# EAGLE design 3 (EAGLE 6.1)
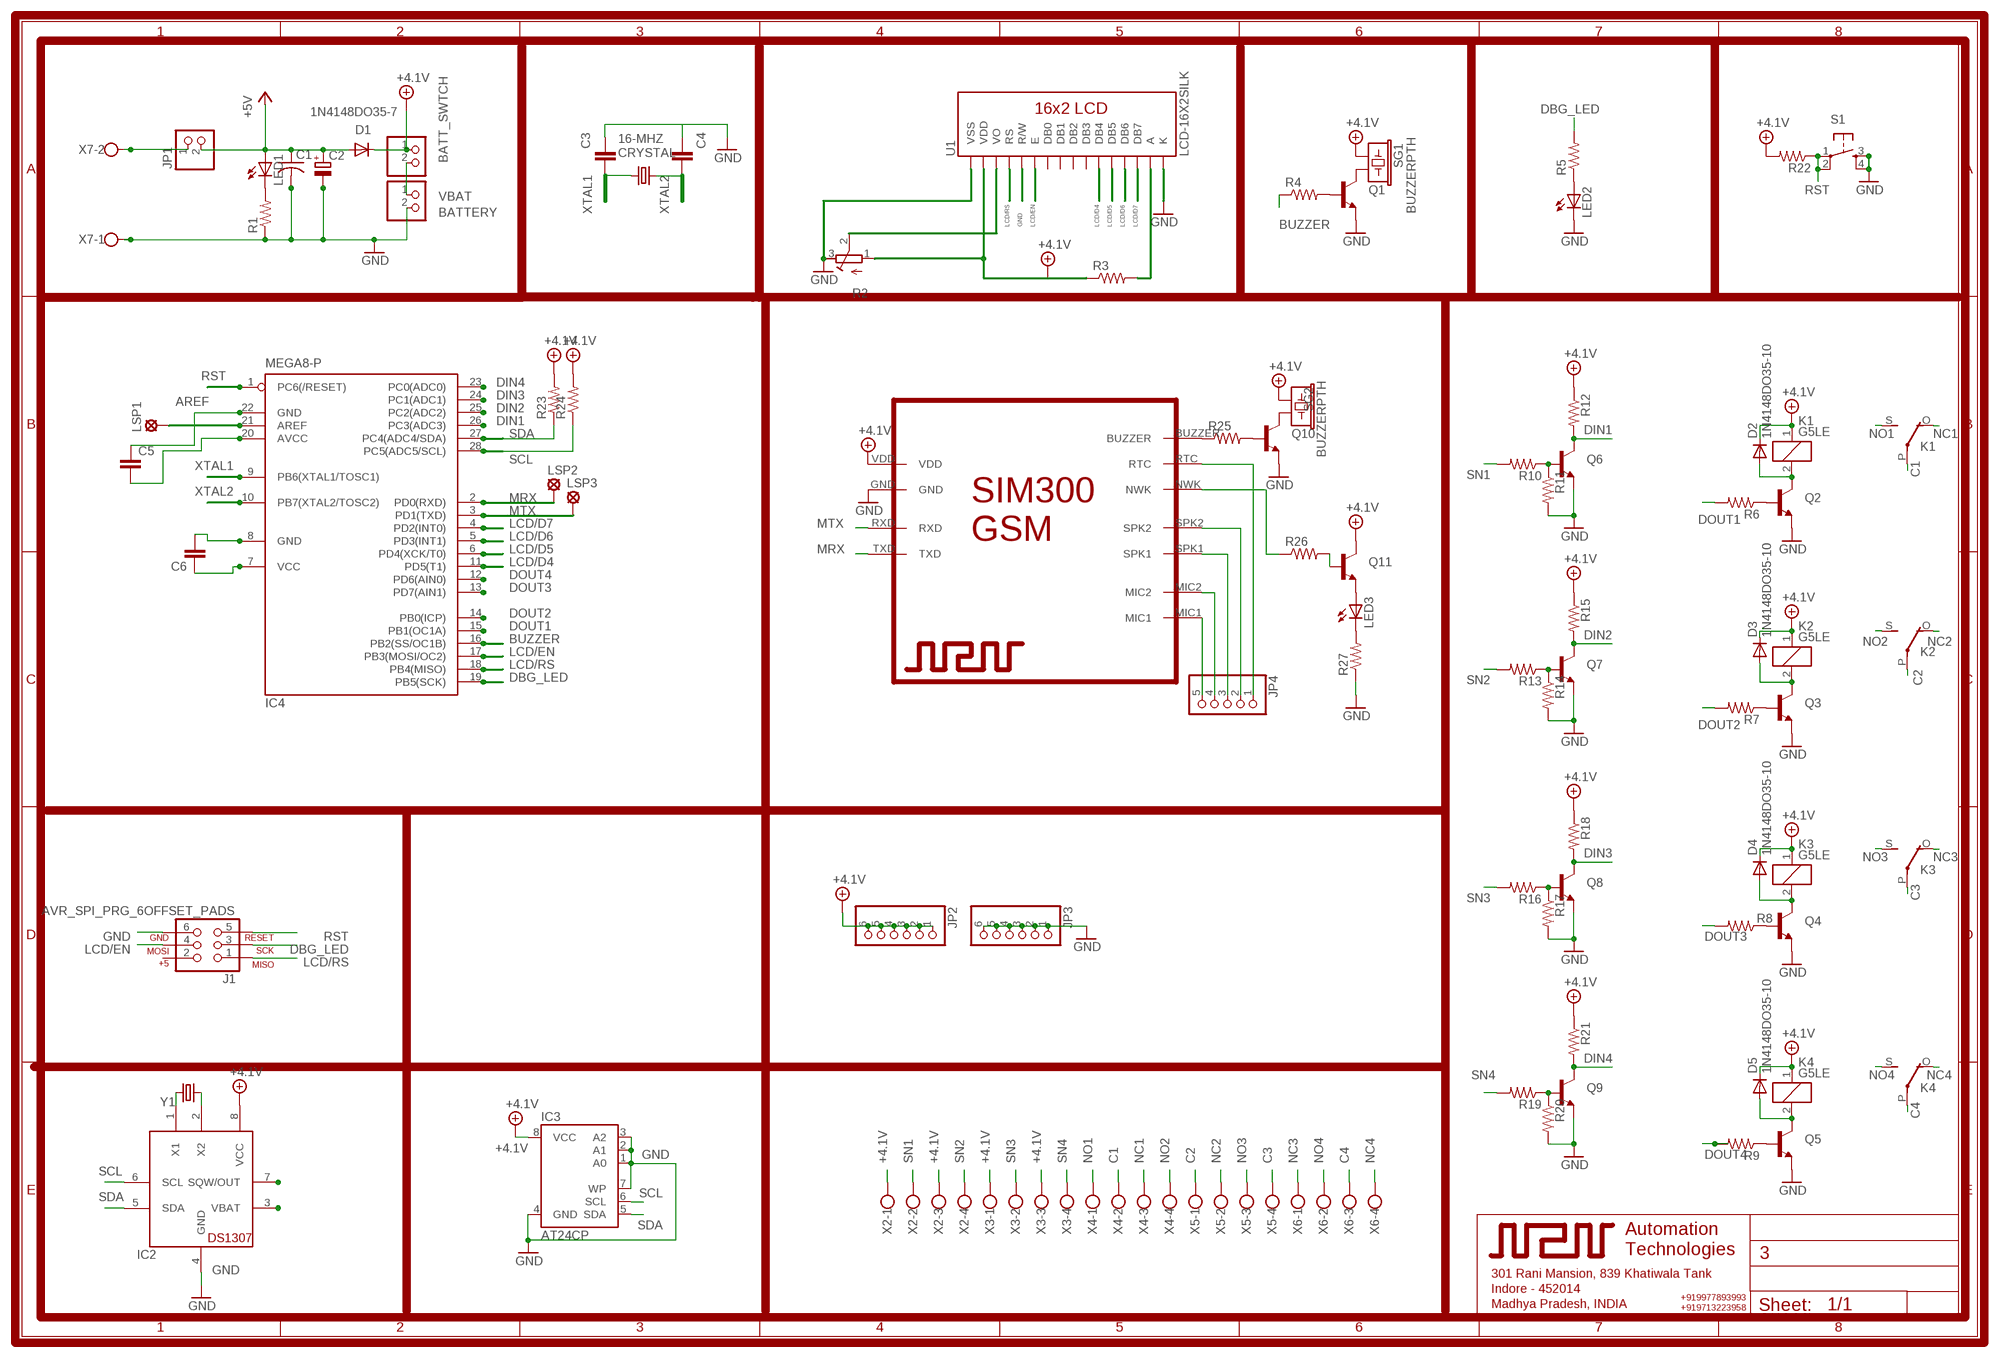
[diagram p0: schematic, sheet 1]

## Parts
BATT_SWTCH  PINHD-1X2  [1X02]
BATTERY  PINHD-1X2  [1X02]
C1  C-US050-035X075  [C050-035X075]
C2  CPOL-EUE3.5-8  [E3,5-8]
C3  CAPPTH1  [CAP-PTH-5MM]
C4  CAPPTH1  [CAP-PTH-5MM]
C5  CAPPTH1  [CAP-PTH-5MM]
C6  CAPPTH1  [CAP-PTH-5MM]
CRYSTAL  16-MHZ  CRYSTALHC49UV  [HC49U-V]
D1  1N4148DO35-7  [DO35-7]
D2  1N4148DO35-10  [DO35-10]
D3  1N4148DO35-10  [DO35-10]
D4  1N4148DO35-10  [DO35-10]
D5  1N4148DO35-10  [DO35-10]
IC2  DS1307  [DIL08]
IC3  AT24CP  [DIL08]
IC4  MEGA8-P  [DIL28-3]
J1  AVR_SPI_PRG_6OFFSET_PADS  [2X3_OFFSET]
JP1  PINHD-1X2  [1X02]
JP2  PINHD-1X6  [1X06]
JP3  PINHD-1X6  [1X06]
JP4  PINHD-1X5  [1X05]
K1  G5LE  [G5LE]
K2  G5LE  [G5LE]
K3  G5LE  [G5LE]
K4  G5LE  [G5LE]
LED1  LED5MM  [LED5MM]
LED2  LED5MM  [LED5MM]
LED3  LED5MM  [LED5MM]
LSP1  LSP11  [LSP11]
LSP2  MCS10B  [MCS10B]
LSP3  MCS10B  [MCS10B]
Q1  TRANSISTOR_NPNTO-92-AMMO  [TO-92-AMMO]
Q2  TRANSISTOR_NPNTO-92-AMMO  [TO-92-AMMO]
Q3  TRANSISTOR_NPNTO-92-AMMO  [TO-92-AMMO]
Q4  TRANSISTOR_NPNTO-92-AMMO  [TO-92-AMMO]
Q5  TRANSISTOR_NPNTO-92-AMMO  [TO-92-AMMO]
Q6  TRANSISTOR_NPNTO-92-AMMO  [TO-92-AMMO]
Q7  TRANSISTOR_NPNTO-92-AMMO  [TO-92-AMMO]
Q8  TRANSISTOR_NPNTO-92-AMMO  [TO-92-AMMO]
Q9  TRANSISTOR_NPNTO-92-AMMO  [TO-92-AMMO]
Q10  TRANSISTOR_NPNTO-92-AMMO  [TO-92-AMMO]
Q11  TRANSISTOR_NPNTO-92-AMMO  [TO-92-AMMO]
R1  RESISTORPTH-1/2W  [AXIAL-0.5]
R2  R-TRIMM3339P  [RTRIM3339P]
R3  RESISTORPTH-2W  [AXIAL-0.8]
R4  RESISTORPTH-1/2W  [AXIAL-0.5]
R5  RESISTORPTH-1/2W  [AXIAL-0.5]
R6  RESISTORPTH-1/2W  [AXIAL-0.5]
R7  RESISTORPTH-1/2W  [AXIAL-0.5]
R8  RESISTORPTH-1/2W  [AXIAL-0.5]
R9  RESISTORPTH-1/2W  [AXIAL-0.5]
R10  RESISTORPTH-1/2W  [AXIAL-0.5]
R11  RESISTORPTH-1/2W  [AXIAL-0.5]
R12  RESISTORPTH-1/2W  [AXIAL-0.5]
R13  RESISTORPTH-1/2W  [AXIAL-0.5]
R14  RESISTORPTH-1/2W  [AXIAL-0.5]
R15  RESISTORPTH-1/2W  [AXIAL-0.5]
R16  RESISTORPTH-1/2W  [AXIAL-0.5]
R17  RESISTORPTH-1/2W  [AXIAL-0.5]
R18  RESISTORPTH-1/2W  [AXIAL-0.5]
R19  RESISTORPTH-1/2W  [AXIAL-0.5]
R20  RESISTORPTH-1/2W  [AXIAL-0.5]
R21  RESISTORPTH-1/2W  [AXIAL-0.5]
R22  RESISTORPTH-1/2W  [AXIAL-0.5]
R23  RESISTORPTH-1/2W  [AXIAL-0.5]
R24  RESISTORPTH-1/2W  [AXIAL-0.5]
R25  RESISTORPTH-1/2W  [AXIAL-0.5]
R26  RESISTORPTH-1/2W  [AXIAL-0.5]
R27  RESISTORPTH-1/2W  [AXIAL-0.5]
S1  TAC_SWITCHPTH  [TACTILE-PTH]
SG1  BUZZERPTH  [BUZZER-12MM]
SG2  BUZZERPTH  [BUZZER-12MM]
U1  LCD-16X2SILK  [LCD-16X2]
U$1  SIM300  [1X10]
X2  W237-4  [W237-4]
X3  W237-4  [W237-4]
X4  W237-4  [W237-4]
X5  W237-4  [W237-4]
X6  W237-4  [W237-4]
X7  W237-102  [W237-102]
Y1  CRYSTALTC38H  [TC38H]

## Nets
+4.1V: BATT_SWTCH.1 C5.2 C6.1 D1.C D2.C D3.C D4.C D5.C IC2.8(VCC) IC3.8(VCC) IC4.7(VCC) IC4.20(AVCC) JP2.1 JP2.2 JP2.3 JP2.4 JP2.5 JP2.6 K1.1 K2.1 K3.1 K4.1 Q11.3(C) R2.1(A) R3.P$1 R12.P$1 R15.P$1 R18.P$1 R21.P$1 R22.P$2 R23.P$2 R24.P$2 SG1.+ SG2.+ U1.2(VDD) U$1.VDD X2.1 X2.3 X3.1 X3.3
+5V: C1.1 C2.+ D1.A JP1.2 LED1.A
AREF: IC4.21(AREF) LSP1.MP
BUZZER: IC4.16(PB2(SS/OC1B)) R4.P$1
C1: K1.P(2:P) X4.2
C2: K2.P(2:P) X5.1
C3: K3.P(2:P) X5.4
C4: K4.P(2:P) X6.3
DBG_LED: IC4.19(PB5(SCK)) J1.3 R5.P$2
DIN1: IC4.26(PC3(ADC3)) Q6.3(C) R12.P$2
DIN2: IC4.25(PC2(ADC2)) Q7.3(C) R15.P$2
DIN3: IC4.24(PC1(ADC1)) Q8.3(C) R18.P$2
DIN4: IC4.23(PC0(ADC0)) Q9.3(C) R21.P$2
DOUT1: IC4.15(PB1(OC1A)) R6.P$2
DOUT2: IC4.14(PB0(ICP)) R7.P$2
DOUT3: IC4.13(PD7(AIN1)) R8.P$2
DOUT4: IC4.12(PD6(AIN0)) R9.P$2
GND: BATTERY.2 C1.2 C2.- C3.1 C4.1 C5.1 C6.2 IC2.4(GND) IC3.1(A0) IC3.2(A1) IC3.3(A2) IC3.4(GND) IC3.7(WP) IC4.8(GND) IC4.22(GND) J1.6 JP3.1 JP3.2 JP3.3 JP3.4 JP3.5 JP3.6 LED2.K(C) Q1.1(E) Q2.1(E) Q3.1(E) Q4.1(E) Q5.1(E) Q6.1(E) Q7.1(E) Q8.1(E) Q9.1(E) Q10.1(E) R1.P$1 R2.3(E) R11.P$2 R14.P$2 R17.P$2 R20.P$2 R27.P$1 S1.3 S1.4 U1.1(VSS) U1.5(R/W) U1.16(K) U$1.GND X7.1
LCD/D4: IC4.11(PD5(T1)) U1.11(DB4)
LCD/D5: IC4.6(PD4(XCK/T0)) U1.12(DB5)
LCD/D6: IC4.5(PD3(INT1)) U1.13(DB6)
LCD/D7: IC4.4(PD2(INT0)) U1.14(DB7)
LCD/EN: IC4.17(PB3(MOSI/OC2)) J1.4 U1.6(E)
LCD/RS: IC4.18(PB4(MISO)) J1.1 U1.4(RS)
MRX: IC4.2(PD0(RXD)) LSP2.MP U$1.TXD
MTX: IC4.3(PD1(TXD)) LSP3.MP U$1.RXD
N$1: JP1.1 X7.2
N$2: LED1.K(C) R1.P$2
N$3: LED3.A Q11.1(E)
N$6: R2.2(S) U1.3(VO)
N$7: Q1.3(C) SG1.-
N$8: Q1.2(B) R4.P$2
N$9: LED2.A R5.P$1
N$10: D2.A K1.2 Q2.3(C)
N$11: Q2.2(B) R6.P$1
N$12: D3.A K2.2 Q3.3(C)
N$13: Q3.2(B) R7.P$1
N$14: R3.P$2 U1.15(A)
N$17: D4.A K3.2 Q4.3(C)
N$18: Q4.2(B) R8.P$1
N$19: D5.A K4.2 Q5.3(C)
N$20: Q5.2(B) R9.P$1
N$21: Q6.2(B) R10.P$1 R11.P$1
N$22: JP4.5 U$1.MIC1
N$23: JP4.4 U$1.MIC2
N$24: JP4.3 U$1.SPK1
N$25: Q7.2(B) R13.P$1 R14.P$1
N$26: JP4.2 U$1.SPK2
N$27: JP4.1 U$1.RTC
N$28: Q8.2(B) R16.P$1 R17.P$1
N$29: IC2.1(X1) Y1.2
N$30: R25.P$1 U$1.BUZZER
N$31: Q9.2(B) R19.P$1 R20.P$1
N$32: IC2.2(X2) Y1.1
N$33: Q10.2(B) R25.P$2
N$34: Q10.3(C) SG2.-
N$35: Q11.2(B) R26.P$2
N$36: LED3.K(C) R27.P$2
N$37: R26.P$1 U$1.NWK
N$40: IC2.7(SQW/OUT)
NC1: K1.O(2:O) X4.3
NC2: K2.O(2:O) X5.2
NC3: K3.O(2:O) X6.1
NC4: K4.O(2:O) X6.4
NO1: K1.S(2:S) X4.1
NO2: K2.S(2:S) X4.4
NO3: K3.S(2:S) X5.3
NO4: K4.S(2:S) X6.2
RST: IC4.1(PC6(/RESET)) J1.5 R22.P$1 S1.1 S1.2
SCL: IC2.6(SCL) IC3.6(SCL) IC4.28(PC5(ADC5/SCL)) R24.P$1
SDA: IC2.5(SDA) IC3.5(SDA) IC4.27(PC4(ADC4/SDA)) R23.P$1
SN1: R10.P$2 X2.2
SN2: R13.P$2 X2.4
SN3: R16.P$2 X3.2
SN4: R19.P$2 X3.4
VBAT: BATT_SWTCH.2 BATTERY.1 IC2.3(VBAT)
XTAL1: C3.2 CRYSTAL.1 IC4.9(PB6(XTAL1/TOSC1))
XTAL2: C4.2 CRYSTAL.2 IC4.10(PB7(XTAL2/TOSC2))
Unconnected: J1.2 U1.7(DB0) U1.8(DB1) U1.9(DB2) U1.10(DB3)

## Library data of the parts
BATT_SWTCH BATTERY JP1 = pinhead:PINHD-1X2: PIN HEADER
C1 = rcl:C-US: CAPACITOR, American symbol
C2 = rcl:CPOL-EU: POLARIZED CAPACITOR, European symbol
C3-C6 = SparkFun_NPN:CAP: Capacitor Standard 0603 ceramic capacitor, and 0.1" leaded capacitor.
CRYSTAL Y1 = SparkFun_NPN:CRYSTAL: Crystals Various standard crystals. Proven footprints. Spark Fun Electronics SKU : COM-00534
D1-D5 = diode:1N4148: DIODE high speed (Philips)
IC2 = adafruit:DS1307: DS1307 Real time clock (RTC) with battery backup ability. Talk to it via i2c
IC3 = atmel:AT24C*: 2-wire serial EEPROM; MPN: AT24C1024BW-SH-B; OC_FARNELL: 1362646; OC_NEWARK: 03P2044
IC4 = atmel:MEGA8-P: MICROCONTROLLER 8 Kbytes FLASH, 1 kbytes SRAM, 512 bytes EEPROM, USART, 4-channel 10 bit ADC, 2-channel 8 bit ADC Pin compatible with Atmega48, ATMega88, ATMega168 Source: avr.lbr; OC_FARNELL: unknown; OC_NEWARK: unknown
J1 = SparkFun:AVR_SPI_PRG_6: AVR ISP 6 Pin This is the reduced ISP connector for AVR programming. Common on Arduino. This footprint will take up less PCB space and can be used with a 10-pin to 6-pin adapter such as SKU: BOB-08508
JP2 JP3 = pinhead:PINHD-1X6: PIN HEADER
JP4 = pinhead:PINHD-1X5: PIN HEADER
K1-K4 = relay:G5LE: RELAY 1 x switch, 10 A/120 V AC, 8 A/30 V DC, Omron; OC_FARNELL: unknown; OC_NEWARK: unknown
LED1-LED3 = led:LED: LED OSRAM: - CHIPLED LG R971, LG N971, LY N971, LG Q971, LY Q971, LO R971, LY R971 LH N974, LH R974 LS Q976, LO Q976, LY Q976 LO Q996 - Hyper CHIPLED LW Q18S LB Q993, LB Q99A, LB R99A - SideLED LS A670, LO A670, LY A670, LG A670, LP A670 LB A673, LV A673, LT A673, LW A673 LH A674 LY A675 LS A676, LA A676, LO A676, LY A676, LW A676 LS A679, LY A679, LG A679 - Hyper Micro SIDELED® LS Y876, LA Y876, LO Y876, LY Y876 LT Y87S - SmartLED LW L88C, LW L88S LB L89C, LB L89S, LG L890 LS L89K, LO L89K, LY L89K LS L896, LA L896, LO L896, LY L896 - TOPLED LS T670, LO T670, LY T670, LG T670, LP T670 LSG T670, LSP T670, LSY T670, LOP T670, LYG T670 LG T671, LOG T671, LSG T671 LB T673, LV T673, LT T673, LW T673 LH T674 LS T676, LA T676, LO T676, LY T676, LB T676, LH T676, LSB T676, LW T676 LB T67C, LV T67C, LT T67C, LS T67K, LO T67K, LY T67K, LW E67C LS E67B, LA E67B, LO E67B, LY E67B, LB E67C, LV E67C, LT E67C LW T67C LS T679, LY T679, LG T679 LS T770, LO T770, LY T770, LG T770, LP T770 LB T773, LV T773, LT T773, LW T773 LH T774 LS E675, LA E675, LY E675, LS T675 LS T776, LA T776, LO T776, LY T776, LB T776 LHGB T686 LT T68C, LB T68C - Hyper Mini TOPLED® LB M676 - Mini TOPLED Santana® LG M470 LS M47K, LO M47K, LY M47K Source: http://www.osram.convergy.de LUXEON: - LUMILED® LXK2-PW12-R00, LXK2-PW12-S00, LXK2-PW14-U00, LXK2-PW14-V00 LXK2-PM12-R00, LXK2-PM12-S00, LXK2-PM14-U00 LXK2-PE12-Q00, LXK2-PE12-R00, LXK2-PE12-S00, LXK2-PE14-T00, LXK2-PE14-U00 LXK2-PB12-K00, LXK2-PB12-L00, LXK2-PB12-M00, LXK2-PB14-N00, LXK2-PB14-P00, LXK2-PB14-Q00 LXK2-PR12-L00, LXK2-PR12-M00, LXK2-PR14-Q00, LXK2-PR14-R00 LXK2-PD12-Q00, LXK2-PD12-R00, LXK2-PD12-S00 LXK2-PH12-R00, LXK2-PH12-S00 LXK2-PL12-P00, LXK2-PL12-Q00, LXK2-PL12-R00 Source: www.luxeon.com KINGBRIGHT: KA-3528ASYC Source: www.kingbright.com
LSP1 = solpad:LSP11: SOLDER PAD drill 1.1 mm
LSP2 LSP3 = solpad:MCS10B: SOLDER PAD MC S1, distributor Buerklin, 15F505
Q1-Q11 = SparkFun_NPN:TRANSISTOR_NPN: Transistor NPN BJT configuration in SOT23 package. MMBT2222 is the common NPN we use. Double check BCE configuration again layout.
R1 R3-R27 = SparkFun_NPN:RESISTOR: Resistor Basic schematic elements and footprints for 0603, 1206, and PTH resistors.
R2 = rcl:R-TRIMM: Trimm resistor
S1 = SparkFun_NPN:TAC_SWITCH: Momentary Switch Button commonly used for reset or general input. Spark Fun Electronics SKU : COM-00097
SG1 SG2 = SparkFun_NPN:BUZZER: Buzzer 12mm Spark Fun Electronics SKU : Comp-Buzzer
U1 = SparkFun_NPN:LCD-16X2
U$1 = NPN:SIM300
X2-X6 = con-wago-500:W237-4: WAGO SCREW CLAMP; OC_FARNELL: unknown; OC_NEWARK: unknown
X7 = con-wago-500:W237-102: WAGO SCREW CLAMP; MPN: 237-102; OC_FARNELL: unknown; OC_NEWARK: 70K9898

## Board
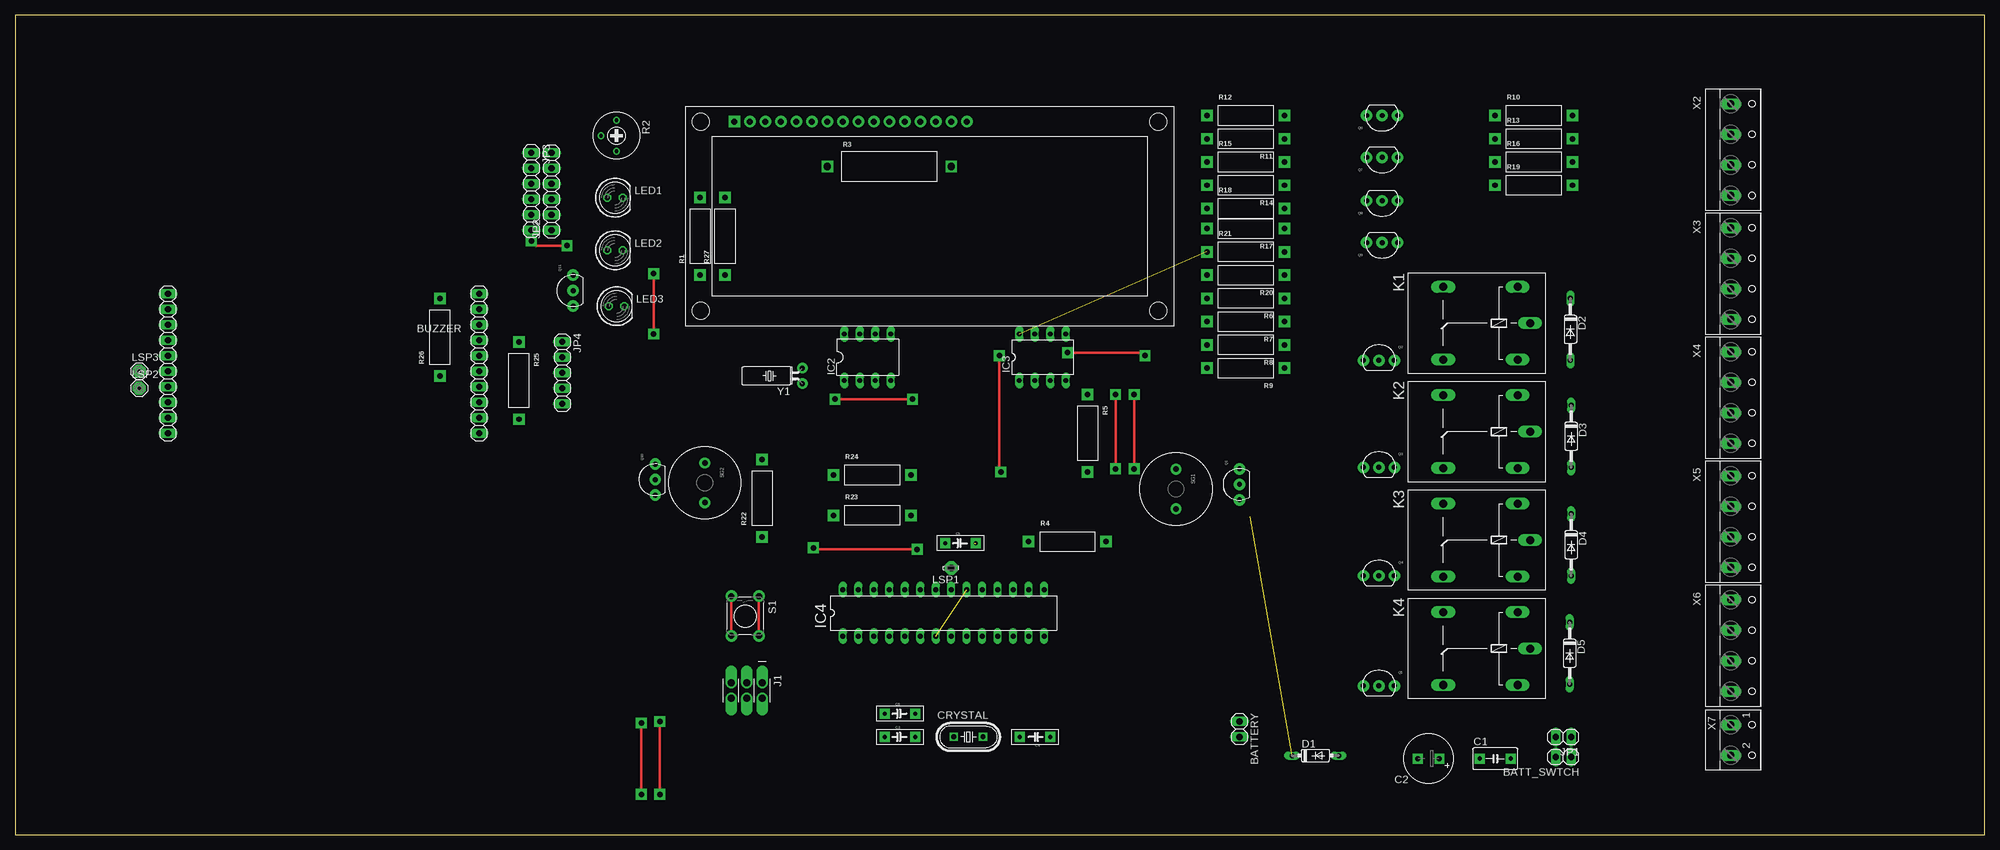
[diagram p1: board, top side]
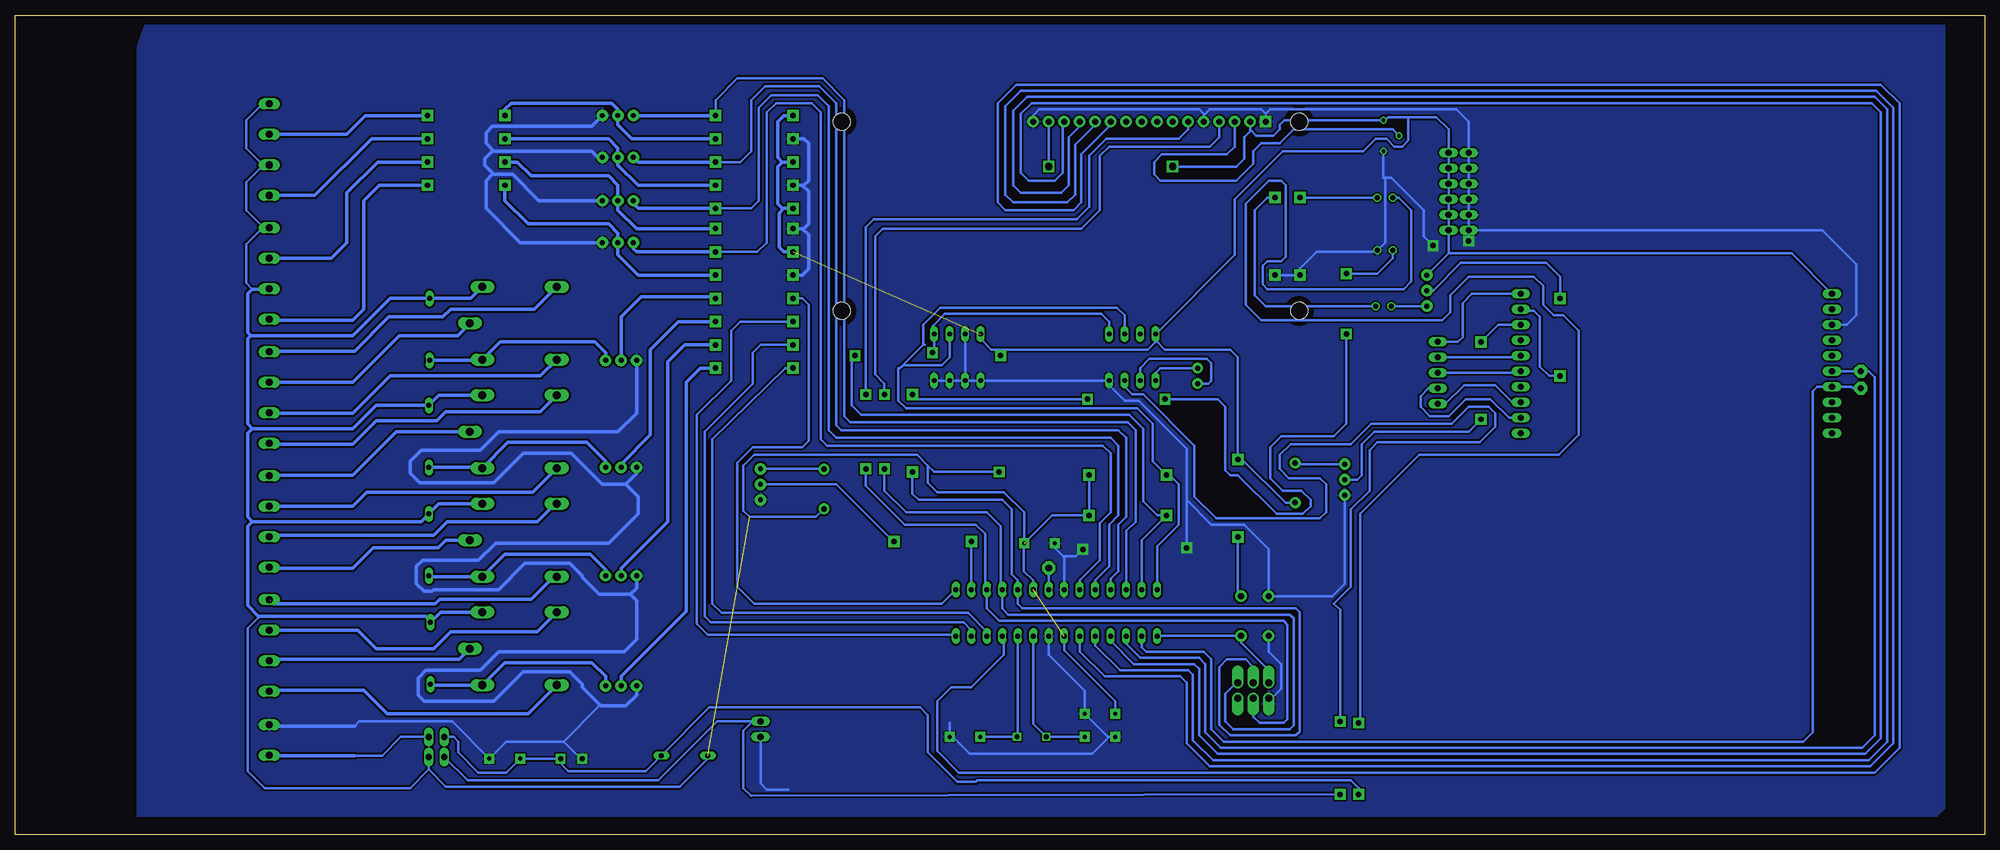
[diagram p2: board, bottom side, seen from below]

Size 322.81 x 134.29 mm. Coordinates in mm from the lower left corner, seen from the top.
Outline: 0,0 322.81,0 322.81,134.29 0,134.29 0,0
Copper layers (1*16): Top 0.035mm / dielectric 1.5mm / Bottom 0.035mm
Design rules: minimum track width 10mil, minimum drill 24mil, track to track 8mil, track to pad 8mil, pad to pad 8mil, via to via 8mil, smd to smd 8mil, copper to edge 40mil, drill to drill 8mil, minimum pad ring 10mil, minimum via ring 8mil, stop-mask expansion 4mil, vias tented up to drill 0mil, thermal gap 10mil

### Footprints (pad centres in the part's own frame; a part is rotated, then mirrored left to right if it is on the bottom)
1X02 = drill 1.016 long: 1 -1.27,0; 2 1.27,0
C050-035X075 = drill 0.7 pad 1.676 square: 1 -2.54,0; 2 2.54,0
E3,5-8 = drill 0.813 pad 1.6 square: + -1.778,0; - 1.778,0
CAP-PTH-5MM = drill 0.7 pad 1.651 square: 1 -2.5,0; 2 2.5,0
HC49U-V = drill 0.813 square: 1 -2.413,0; 2 2.413,0
DO35-7 = drill 0.813 long: A 3.81,0; C -3.81,0
DO35-10 = drill 0.813 long: A 5.08,0; C -5.08,0
DIL08 = drill 0.813 long: 1 -3.81,-3.81; 2 -1.27,-3.81; 3 1.27,-3.81; 4 3.81,-3.81; 5 3.81,3.81; 6 1.27,3.81; 7 -1.27,3.81; 8 -3.81,3.81
DIL28-3 = drill 0.813 long: 1 -16.51,-3.81; 2 -13.97,-3.81; 3 -11.43,-3.81; 4 -8.89,-3.81; 5 -6.35,-3.81; 6 -3.81,-3.81; 7 -1.27,-3.81; 8 1.27,-3.81; 9 3.81,-3.81; 10 6.35,-3.81; 11 8.89,-3.81; 12 11.43,-3.81; 13 13.97,-3.81; 14 16.51,-3.81; 15 16.51,3.81; 16 13.97,3.81; 17 11.43,3.81; 18 8.89,3.81; 19 6.35,3.81; 20 3.81,3.81; 21 1.27,3.81; 22 -1.27,3.81; 23 -3.81,3.81; 24 -6.35,3.81; 25 -8.89,3.81; 26 -11.43,3.81; 27 -13.97,3.81; 28 -16.51,3.81
2X3_OFFSET = drill 1.118 pad 1.88 offset: 1 -2.54,-1.27; 2 -2.54,1.27; 3 0,-1.27; 4 0,1.27; 5 2.54,-1.27; 6 2.54,1.27
1X06 = drill 1.016 long: 1 -6.35,0; 2 -3.81,0; 3 -1.27,0; 4 1.27,0; 5 3.81,0; 6 6.35,0
1X05 = drill 1.016 long: 1 -5.08,0; 2 -2.54,0; 3 0,0; 4 2.54,0; 5 5.08,0
G5LE = drill 1.321 long: 1 -7.493,-5.969; 2 -7.493,5.969; O 4.699,5.969; P -9.525,0; S 4.699,-5.969
LED5MM = drill 0.813 octagon: A -1.27,0; K 1.27,0
LSP11 = drill 1.118 pad 2.159 octagon: MP 0,0
MCS10B = drill 1.016 pad 2.159 octagon: MP 0,0
TO-92-AMMO = drill 0.813 pad 1.88: 1 -2.54,0; 2 0,0; 3 2.54,0
AXIAL-0.5 = drill 0.9 pad 1.88 square: P$1 -6.35,0; P$2 6.35,0
RTRIM3339P = drill 0.61: 1 -2.54,0; 2 0,-2.54; 3 2.54,0
AXIAL-0.8 = drill 1.2 pad 1.88 square: P$1 -10.16,0; P$2 10.16,0
TACTILE-PTH = drill 1.016 pad 1.88: 1 -3.251,2.261; 2 3.251,2.261; 3 -3.251,-2.261; 4 3.251,-2.261
BUZZER-12MM = drill 0.9 pad 1.778: + 3.25,0; - -3.25,0
LCD-16X2 = drill 1.016 pad 1.88 square: 1 -32,15.5 | drill 1.016 pad 1.88: 2 -29.46,15.5; 3 -26.92,15.5; 4 -24.38,15.5; 5 -21.84,15.5; 6 -19.3,15.5; 7 -16.76,15.5; 8 -14.22,15.5; 9 -11.68,15.5; 10 -9.14,15.5; 11 -6.6,15.5; 12 -4.06,15.5; 13 -1.52,15.5; 14 1.02,15.5; 15 3.56,15.5; 16 6.1,15.5 | hole 2.8: -37.5,15.5; -37.5,-15.5; 37.5,15.5; 37.5,-15.5
1X10 = drill 1.016 long: 17 25.5,3.81; ADC0 -25.5,-11.43; AGND 25.5,-3.81; BUZZER 25.5,6.35; CTS -25.5,-8.89; GND -25.5,6.35; GND1 -25.5,3.81; GND2 25.5,-11.43; MIC1 25.5,-6.35; MIC2 25.5,-8.89; NWK 25.5,8.89; PS-ON -25.5,1.27; RTC 25.5,11.43; RTS -25.5,-6.35; RXD -25.5,-1.27; SPK1 25.5,-1.27; SPK2 25.5,1.27; TXD -25.5,-3.81; VDD -25.5,11.43; VDD1 -25.5,8.89
W237-4 = drill 1.194 long: 1 -7.5,-1.27; 2 -2.5,-1.27; 3 2.5,-1.27; 4 7.5,-1.27
W237-102 = drill 1.194 long: 1 -2.5,-1.27; 2 2.5,-1.27
TC38H = drill 0.813 pad 1.676: 1 -1.27,0; 2 1.27,0

### Placement (x,y rotation side)
BATT_SWTCH  253.75,12.7 180 top
BATTERY  200.66,17.27 270 top
C1  242.57,12.45 0 top
C2  231.65,12.45 180 top
C3  145.03,16 0 top
C4  167.13,16 180 top
C5  154.94,47.75 0 top
C6  145.03,19.81 0 top
CRYSTAL  156.21,16 0 top
D1  213.11,12.95 0 top
D2  254.89,82.8 270 top
D3  255.02,65.28 270 top
D4  255.02,47.5 270 top
D5  254.76,29.72 270 top
IC2  139.7,78.23 0 top
IC3  168.4,78.23 0 top
IC4  152.15,36.32 0 top
J1  119.89,23.62 180 top
JP1  253.75,16 180 top
JP2  87.88,105.41 90 top
JP3  84.58,105.41 270 top
JP4  89.66,75.69 270 top
K1  238.76,83.82 180 top
K2  238.76,66.04 180 top
K3  238.76,48.26 180 top
K4  238.76,30.48 180 top
LED1  98.3,104.39 0 top
LED2  98.3,95.76 0 top
LED3  98.55,86.61 0 top
LSP1  153.42,43.69 180 top
LSP2  20.32,73.15 0 top
LSP3  20.32,75.95 0 top
Q1  200.66,57.4 90 top
Q2  223.52,77.72 0 top
Q3  223.52,60.2 0 top
Q4  223.52,42.42 0 top
Q5  223.52,24.38 0 top
Q6  224.03,117.86 180 top
Q7  224.03,111 180 top
Q8  224.03,103.89 180 top
Q9  224.03,97.03 180 top
Q10  104.9,58.17 90 top
Q11  91.44,89.15 90 top
R1  112.27,98.04 90 top
R2  98.55,114.55 270 top
R3  143.26,109.47 0 top
R4  172.47,48.01 0 top
R5  175.77,65.79 270 top
R6  201.68,87.88 180 top
R7  201.68,84.07 180 top
R8  201.68,80.26 180 top
R9  201.68,76.45 180 top
R10  248.92,117.86 0 top
R11  201.68,114.05 180 top
R12  201.68,117.86 0 top
R13  248.92,114.05 0 top
R14  201.68,106.43 180 top
R15  201.68,110.24 0 top
R16  248.92,110.24 0 top
R17  201.68,99.31 180 top
R18  201.68,102.62 0 top
R19  248.92,106.43 0 top
R20  201.68,91.69 180 top
R21  201.68,95.5 0 top
R22  122.43,55.12 90 top
R23  140.46,52.32 0 top
R24  140.46,58.93 0 top
R25  82.55,74.42 270 top
R26  69.6,81.53 90 top
R27  116.33,98.04 90 top
S1  119.63,35.81 270 top
SG1  190.25,56.64 270 top
SG2  113.03,57.66 270 top
U1  149.86,101.35 0 top
U$1  50.55,77.22 0 top
X2  282.45,112.27 270 top
X3  282.45,91.95 270 top
X4  282.45,71.63 270 top
X5  282.45,51.31 270 top
X6  282.45,30.99 270 top
X7  282.45,15.49 270 top
Y1  129.03,75.18 90 top

### Tracks (layer width: path | path; a pad name or v marks a point on that pad's centre or on a via)
+4.1V  (via drill 0.9 pad 1.78)  (5 unrouted)
  Top 0.406: v161.54,59.44 161.29,59.69 v161.29,78.49
  Bottom 0.406: IC4.7 150.88,30.23 142.53,21.88 C6.1 | IC4.20 155.96,41.66 157.48,43.18 157.48,47.5 157.23,47.75 | R24.P$2 R23.P$2 152.87,52.32 C5.2 157.44,52.79 160.78,56.13 171.7,56.13 173.23,57.66 173.23,60.45 | SG1.+ 191.57,52.07 202.44,52.07 203.45,53.09 203.45,60.45 201.68,62.23 175.01,62.23 173.23,60.45 | 98.55,116.84 R2.1 | 98.55,116.84 97.79,117.6 94.49,117.6 | 94.49,117.6 89.92,117.6 87.88,115.57 JP2.6 JP2.5 | JP2.5 87.88,108.71 | JP2.5 JP2.4 JP2.3 JP2.2 JP2.1 87.88,95.25 | 135.89,81.03 135.89,80.77 137.16,79.5 161.29,79.5 | 161.29,79.5 162.81,79.5 164.59,81.28 IC3.8 | Q11.3 87.88,95.25 | SG2.+ 113.34,54.1 113.59,54.36 114.55,54.36 121.67,61.47 R22.P$2 122.43,78.23 123.7,79.5 134.37,79.5 135.89,81.03 | 135.89,81.03 IC2.8 122.94,95 122.94,104.14 115.06,112.01 101.85,112.01 99.82,114.05 98.04,114.05 96.77,112.78 95.5,112.78 94.49,113.79 94.49,117.6 | U$1.VDD 31.65,95.25 87.88,95.25 | 255.02,10.67 252.22,7.87 213.87,7.87 209.3,12.45 D1.C | BATT_SWTCH.1 255.02,10.67 | 255.02,10.67 258.06,7.62 281.94,7.62 284.73,10.41 284.73,33.78 282.96,35.56 282.96,35.81 | 120.4,115.57 119.38,114.55 116.59,114.55 115.57,115.57 115.57,116.33 114.81,117.09 98.81,117.09 98.55,116.84 | 120.4,115.57 U1.2 | 120.4,115.57 120.4,115.32 121.41,114.3 121.41,110.74 122.68,109.47 R3.P$1 | 173.23,60.45 172.21,59.44 v161.54,59.44 | v161.29,78.49 161.29,79.5 | X2.1 281.31,119.63 282.45,119.63 284.99,117.09 284.99,112.52 282.19,109.73 | 281.22,109.73 281.18,109.73 | X2.3 281.22,109.73 | 281.22,109.73 282.19,109.73 | 282.19,109.73 284.99,106.93 284.99,102.36 282.19,99.57 | 282.19,99.57 282.07,99.45 X3.1 281.3,99.57 282.19,99.57
  Bottom 0.406: 282.19,99.57 284.99,96.77 284.99,90.42 283.97,89.41
  Bottom 0.61: K1.1 248.16,87.88 D2.C 261.37,87.88 267.46,81.79 284.23,81.79 | X3.3 281.22,89.41 283.97,89.41 284.73,88.65 284.73,82.3 284.23,81.79 | K2.1 253.37,72.01 D3.C 263.65,70.36 267.46,66.55 283.97,66.55 | 284.23,81.79 284.73,81.28 284.73,67.31 283.97,66.55 | 283.97,51.31 284.73,52.07 284.73,65.79 283.97,66.55 | K3.1 253.37,54.23 D4.C 256.29,51.31 283.97,51.31 | 283.97,51.31 284.73,50.55 284.73,37.59 282.96,35.81 255.52,35.81 254.76,35.05 D5.C 253.11,36.45 K4.1 | R12.P$1 196.85,117.86 197.87,116.84 197.87,111 197.1,110.24 | R15.P$1 197.1,110.24 | 197.1,110.24 197.87,109.47 197.87,103.38 197.1,102.62 196.85,102.62 | R18.P$1 196.85,102.62 | 196.85,102.62 197.61,101.85 197.61,96.27 196.85,95.5 R21.P$1
+5V  (via drill 0.9 pad 1.78)
  Top 0.406: v102.62,6.6 v102.62,18.29
  Bottom 0.406: 233.93,12.45 C1.1 242.32,10.16 246.89,10.16 250.19,13.46 250.19,15.24 250.95,16 JP1.2 | 233.93,12.45 C2.+ | 233.93,12.45 233.93,12.19 232.16,10.41 219.46,10.41 D1.A 209.04,20.83 174.5,20.83 173.23,19.56 173.23,13.46 168.4,8.64 165.35,8.64 165.1,8.89 103.89,8.89 102.62,7.62 v102.62,6.6 | v102.62,18.29 102.36,18.54 102.36,52.58 92.71,62.23 69.85,62.23 66.55,65.53 66.55,82.55 69.09,85.09 70.61,85.09 72.39,86.87 72.39,89.92 73.91,91.44 84.58,91.44 87.63,88.39 87.63,85.6 88.9,84.33 118.62,84.33 121.16,86.87 121.16,103.38 117.35,107.19 115.32,107.19 114.55,106.43 114.55,94.74 115.32,93.98 117.6,93.98 118.36,93.22 118.36,90.17 117.6,89.41 95.25,89.41 93.98,90.68 93.98,102.36 96.01,104.39 LED1.A 97.28,104.39
AREF
  Bottom 0.406: IC4.21 LSP1.MP
BUZZER
  Bottom 0.406: IC4.16 R4.P$1
C1
  Bottom 0.61: K1.P 250.32,81.79 258.57,81.79 258.83,81.79 259.84,81.79 267.46,74.17 281.14,74.17 X4.2
C2
  Bottom 0.61: X5.1 281.06,58.93 267.46,58.93 260.35,66.04 K2.P
C3
  Bottom 0.61: X5.4 281.06,43.69 267.46,43.69 264.16,46.99 253.49,46.99 252.22,48.26 250.7,48.26 250.19,48.26 K3.P
C4
  Bottom 0.61: X6.3 280.96,28.7 250.06,28.7 K4.P
DBG_LED
  Bottom 0.406: J1.3 119.89,27.43 121.16,28.7 124.21,28.7 125.48,27.43 125.48,18.03 123.7,16.26 112.9,16.26 112.27,16.89 112.27,36.45 112.9,37.08 157.73,37.08 158.5,37.85 IC4.19 158.5,41.66 159.51,42.67 159.51,53.34 161.04,54.86 174.75,54.86 175.77,55.88 R5.P$2
DIN1
  Bottom 0.406: R12.P$2 208.03,120.4 204.47,123.95 190.5,123.95 186.94,120.4 186.94,68.58 185.93,67.56 140.46,67.56 139.19,66.29 139.19,51.31 140.72,49.78 IC4.26
  Bottom 0.61: R12.P$2 Q6.3
DIN2
  Bottom 0.406: R15.P$2 203.96,110.24 202.18,112.01 202.18,120.4 199.9,122.68 191.01,122.68 188.21,119.89 188.21,67.06 187.45,66.29 141.99,66.29 140.72,65.02 140.72,52.07 141.99,50.8 141.99,43.18 143.26,41.91 IC4.25
  Bottom 0.61: R15.P$2 220.73,110.24 Q7.3
DIN3
  Bottom 0.406: R18.P$2 202.18,102.62 200.91,103.89 200.91,119.13 198.88,121.16 191.26,121.16 189.48,119.38 189.48,66.29 188.21,65.02 143.26,65.02 141.99,63.75 141.99,52.32 143.51,50.8 143.51,43.94 145.8,41.66 IC4.24
  Bottom 0.61: R18.P$2 220.73,102.62 221.49,103.38 Q8.3
DIN4
  Bottom 0.406: R21.P$2 201.17,95.5 199.64,97.03 199.64,118.36 198.12,119.89 192.28,119.89 190.75,118.36 190.75,64.77 189.74,63.75 144.53,63.75 143.26,62.48 143.26,52.83 145.03,51.05 145.03,44.96 148.34,41.66 IC4.23
  Bottom 0.61: R21.P$2 220.98,95.5 221.49,96.01 Q9.3
DOUT1
  Bottom 0.406: R6.P$2 193.8,87.88 192.79,86.87 192.79,64.52 193.8,63.5 201.93,63.5 204.47,60.96 204.47,40.64 201.68,37.85 170.94,37.85 IC4.15
DOUT2
  Bottom 0.406: IC4.14 168.91,32.77 209.3,32.77 211.07,34.54 211.07,68.83 205.49,74.42 205.49,82.55 203.96,84.07 R7.P$2
DOUT3
  Bottom 0.406: R8.P$2 200.66,80.26 201.93,78.99 201.93,73.91 209.8,66.04 209.8,35.81 208.79,34.8 167.39,34.8 166.12,33.53 IC4.13
DOUT4
  Bottom 0.406: IC4.12 163.58,33.27 166.62,36.32 207.01,36.32 208.53,37.85 208.53,64.77 196.6,76.45 R9.P$2
GND  (via drill 0.9 pad 1.78)
  Top 0.406: S1.3 S1.4 | v130.81,46.99 131.06,46.74 v147.83,46.74 | v84.58,97.28 85.34,96.52 v90.42,96.52
  Bottom 0.406: S1.4 117.35,32.54 117.35,29.97 115.32,27.94 115.32,23.88 116.84,22.35 J1.6 | IC4.8 153.42,29.46 147.53,23.58 C6.2 143.72,16 143.51,16 | C3.1 143.51,16 | 143.51,16 146.3,13.21 166.37,13.21 169.16,16 C4.1 169.67,16.04 169.67,18.29 | IC4.22 150.88,45.47 151,45.59 | 151,45.59 152.44,47.03 C5.1 | Q1.1 200.15,55.37 | U1.16 155.96,117.86 154.94,118.87 128.78,118.87 128.02,118.11 128.02,117.86 | U1.5 | U1.5 | U1.5 128.02,117.86 | 128.02,117.86 127,118.87 118.62,118.87 117.86,118.11 | 117.86,118.11 U1.1 | 117.86,118.11 117.09,118.87 86.61,118.87 84.58,116.84 JP3.1 JP3.2 JP3.3 | R27.P$1 R1.P$1 112.27,92.71 109.47,95.5 99.82,95.5 LED2.K 98.3,97.03 98.3,107.7 98.55,107.95 R2.3 | JP3.3 JP3.4 JP3.5 JP3.6 26.67,99.06 21.08,93.47 21.08,85.09 22.61,83.57 U$1.GND | IC3.7 IC3.2 | IC3.2 IC3.1 IC2.4 143.51,73.66 140.97,71.12 138.68,71.12 130.81,63.25 130.81,54.86 | IC3.2 IC3.3 IC3.4 | Q10.1 104.9,41.15 106.98,39.06 S1.3 117.37,46.76 121.41,50.8 126.75,50.8 130.81,54.86 | 232.92,15.24 230.12,12.45 C2.- | 267.21,17.78 266.45,18.54 251.21,18.54 C1.2 242.32,15.24 232.92,15.24 | 232.92,15.24 227.08,21.08 226.57,21.08 | 130.81,54.86 v130.81,46.99 | v147.83,46.74 148.97,45.59 151,45.59 | BATTERY.2 200.66,8.38 199.64,7.37 196.09,7.37 | JP3.3 v84.58,97.28 | v90.42,96.52 91.95,98.04 91.95,102.36 97.28,107.7 98.55,107.7
  Bottom 0.61: X7.1 280.96,17.78 267.21,17.78 | Q6.1 228.35,116.08 244.6,116.08 245.62,115.06 245.62,113.28 244.35,112.01 | 244.35,112.01 228.35,112.01 227.33,111 Q7.1 | 244.35,108.2 245.87,109.73 245.87,110.74 244.6,112.01 244.35,112.01 | Q8.1 236.98,103.89 241.3,108.2 244.35,108.2 | 244.35,108.2 244.6,108.2 245.62,107.19 245.62,102.62 240.03,97.03 Q9.1 | R11.P$2 193.55,114.05 192.79,113.28 192.79,107.19 193.55,106.43 193.8,106.43 | R14.P$2 193.8,106.43 | 193.8,106.43 192.79,105.41 192.79,100.08 193.55,99.31 193.8,99.31 | R17.P$2 193.8,99.31 | 193.8,99.31 192.79,98.3 192.79,92.71 193.8,91.69 R20.P$2 | Q2.1 220.98,69.09 224.03,66.04 243.59,66.04 246.63,62.99 256.29,62.99 258.06,61.21 258.06,59.18 256.54,57.66 244.35,57.66 239.52,62.48 231.65,62.48 226.57,57.4 222.76,57.4 | Q3.1 220.98,59.18 222.76,57.4 | 222.76,57.4 220.73,55.37 220.73,52.58 225.55,47.75 244.09,47.75 246.89,44.96 256.03,44.96 257.05,43.94 257.05,41.15 255.78,39.88 254.51,39.88 254.25,40.13 243.59,40.13 239.27,44.45 231.9,44.45 229.87,42.42 229.87,42.16 227.08,39.37 222,39.37 | Q4.1 220.98,40.39 222,39.37 | 222,39.37 220.98,38.35 220.98,32 223.01,29.97 243.59,29.97 246.63,26.92 255.52,26.92 256.79,25.65 256.79,22.86 255.78,21.84 244.35,21.84 239.52,26.67 231.9,26.67 229.87,24.64 229.87,24.13 226.82,21.08 226.57,21.08 222.76,21.08 220.98,22.86 Q5.1
  pour Bottom (isolate 0.305): 6.6,132.59 301.5,132.59 302.77,129.03 302.77,3.05 7.87,3.05 6.6,4.32
LCD/D4
  Bottom 0.406: IC4.11 161.04,33.27 160.78,33.02 160.78,29.46 166.12,24.13 169.42,24.13 171.7,21.84 171.7,13.72 168.15,10.16 18.03,10.16 13.97,14.22 13.97,119.89 17.02,122.94 158.75,122.94 161.8,119.89 161.8,103.63 160.53,102.36 149.35,102.36 148.08,103.63 148.08,111.51 143.26,116.33 U1.11
LCD/D5
  Bottom 0.406: IC4.6 148.34,29.97 144.27,25.91 131.83,25.91 130.81,24.89 130.81,14.99 127,11.18 18.8,11.18 14.99,14.99 14.99,119.13 17.78,121.92 157.99,121.92 160.53,119.38 160.53,104.9 159.26,103.63 150.37,103.63 149.1,104.9 149.1,113.03 145.8,116.33 U1.12
LCD/D6
  Bottom 0.406: 145.8,31.5 IC4.5 145.8,30.99 141.73,26.92 130.56,26.92 129.79,26.16 129.79,15.49 126.49,12.19 19.05,12.19 16,15.24 16,118.87 18.03,120.9 156.97,120.9 159.26,118.62 159.26,106.43 157.99,105.16 151.38,105.16 150.11,106.43 150.11,114.3 148.34,116.08 U1.13
LCD/D7
  Bottom 0.406: IC4.4 143.26,31.75 139.45,27.94 129.54,27.94 128.78,27.18 128.78,16.26 125.73,13.21 19.56,13.21 17.02,15.75 17.02,118.36 18.54,119.89 156.21,119.89 157.99,118.11 157.99,108.46 156.72,107.19 152.4,107.19 151.13,108.46 151.13,116.59 U1.14
LCD/EN  (via drill 0.9 pad 1.78)
  Top 0.406: v183.39,59.94 v183.39,72.14
  Bottom 0.406: J1.4 119.89,19.3 118.87,18.29 114.94,18.29 114.3,18.92 114.3,34.42 114.94,35.05 161.54,35.05 163.58,37.08 IC4.17 163.58,40.39 163.83,40.64 163.83,49.28 165.35,50.8 177.04,50.8 183.39,57.15 v183.39,59.94 | U1.6 130.56,115.57 132.08,114.05 144.02,114.05 146.81,111.25 146.81,102.87 148.84,100.84 182.12,100.84 183.39,99.57 v183.39,72.14
LCD/RS  (via drill 0.9 pad 1.78)
  Top 0.406: v180.34,72.14 v180.34,59.94
  Bottom 0.406: J1.1 122.68,24.89 124.46,23.11 124.46,18.54 123.19,17.27 113.92,17.27 113.28,17.91 113.28,35.43 113.92,36.07 160.02,36.07 161.04,37.08 IC4.18 161.04,40.39 161.29,40.64 161.29,50.55 163.58,52.83 176.78,52.83 180.34,56.39 v180.34,59.94 | U1.4 125.48,114.3 127,112.78 143.51,112.78 145.03,111.25 145.03,102.36 148.08,99.31 180.59,99.31 181.86,98.04 181.86,75.44 180.34,73.91 v180.34,72.14
MRX
  Bottom 0.406: IC4.2 138.18,30.73 137.41,29.97 128.02,29.97 126.75,28.7 126.75,17.27 124.71,15.24 29.72,15.24 28.19,16.76 28.19,72.64 27.43,73.41 U$1.TXD 21.84,73.41 21.59,73.15 LSP2.MP
MTX
  Bottom 0.406: IC4.3 140.72,31.24 138.43,28.96 128.78,28.96 127.76,27.94 127.76,16.76 125.22,14.22 20.07,14.22 18.03,16.26 18.03,74.93 19.05,75.95 LSP3.MP U$1.RXD
N$1
  Bottom 0.406: JP1.1 259.59,16 262.64,12.95 267.46,12.95
  Bottom 0.61: X7.2 281.14,12.95 267.97,12.95 267.46,12.95 267.21,12.95
N$2
  Bottom 0.406: LED1.K R1.P$2
N$3
  Bottom 0.406: LED3.A Q11.1 90.93,86.61
N$6
  Bottom 0.406: U1.3 122.94,112.77 124.21,111.51 134.87,111.51 136.14,110.24 136.14,108.2 135.13,107.19 122.68,107.19 119.89,109.98 119.89,112.01 118.62,113.28 115.57,113.28 113.28,115.57 97.03,115.57 R2.2
N$7
  Bottom 0.406: SG1.- 190.3,59.94 Q1.3
N$8
  Bottom 0.406: R4.P$2 188.21,57.4 Q1.2
N$9  (via drill 0.9 pad 1.78)
  Top 0.406: v104.65,91.95 v104.65,82.04 | v134.37,71.37 v147.07,71.37
  Bottom 0.406: LED2.A 97.03,94.49 99.57,91.95 v104.65,91.95 | v104.65,82.04 104.65,67.31 106.68,65.28 115.32,65.28 117.09,63.5 117.09,58.42 115.06,56.39 112.01,56.39 110.49,54.86 110.49,53.85 111.76,52.58 116.08,52.58 122.43,58.93 123.7,58.93 124.46,59.69 124.46,70.1 125.73,71.37 v134.37,71.37 | v147.07,71.37 175.26,71.37 175.77,71.88 R5.P$1
N$10
  Bottom 0.61: D2.A 246.38,77.72 K1.2 243.33,80.77 227.84,80.77 226.06,78.99 Q2.3
N$11
  Bottom 0.61: R6.P$1 208.28,88.14 220.22,88.14 223.52,84.84 Q2.2
N$12
  Bottom 0.61: D3.A 246.38,60.2 K2.2 242.06,64.26 229.11,64.26 226.06,61.21 Q3.3
N$13
  Bottom 0.61: R7.P$1 214.12,84.07 218.69,79.5 218.69,65.53 223.52,60.71 Q3.2
N$14
  Bottom 0.406: U1.15 R3.P$2
N$17
  Bottom 0.61: D4.A 254.89,42.29 K3.2 243.33,45.21 243.08,45.47 242.57,45.97 228.6,45.97 226.06,43.43 Q4.3
N$18
  Bottom 0.61: Q4.2 223.52,43.69 215.9,51.31 215.9,77.47 213.11,80.26 R8.P$1
N$19
  Bottom 0.61: D5.A 254.63,24.51 K4.2 242.57,28.19 228.35,28.19 226.06,25.91 Q5.3
N$20
  Bottom 0.61: R9.P$1 210.57,76.45 212.85,74.17 212.85,36.58 223.52,25.91 Q5.2
N$21
  Bottom 0.61: R10.P$1 242.57,118.87 241.55,119.89 225.04,119.89 224.03,118.87 Q6.2 224.03,116.33 221.74,114.05 R11.P$1
N$22
  Bottom 0.406: U$1.MIC1 77.47,70.87 80.26,73.66 85.34,73.66 88.39,70.61 JP4.5
N$23
  Bottom 0.406: U$1.MIC2 77.98,68.33 81.03,71.37 85.09,71.37 87.88,68.58 90.93,68.58 92.46,70.1 92.46,71.88 91.19,73.15 JP4.4
N$24
  Bottom 0.406: U$1.SPK1 76.3,75.69 JP4.3
N$25
  Bottom 0.61: R13.P$1 225.55,114.05 224.03,112.52 Q7.2 224.03,109.73 220.73,106.43 R14.P$1
N$26
  Bottom 0.406: U$1.SPK2 76.3,78.23 JP4.2
N$27
  Bottom 0.406: U$1.RTC 84.07,88.65 85.6,87.12 85.6,81.53 86.36,80.77 JP4.1
N$28
  Bottom 0.61: R16.P$1 240.54,110.24 238.25,107.95 225.55,107.95 224.03,106.43 Q8.2 224.03,102.36 220.98,99.31 R17.P$1
N$29
  Bottom 0.406: Y1.2 135.13,76.45 135.89,75.69 IC2.1
N$30
  Bottom 0.406: U$1.BUZZER 79.76,83.57 R25.P$1
N$31
  Bottom 0.61: R19.P$1 242.57,103.89 238.76,100.08 225.55,100.08 224.03,98.55 Q9.2 224.03,95 220.73,91.69 R20.P$1
N$32
  Bottom 0.406: Y1.1 127.25,73.91 126.75,74.42 126.75,77.22 127.51,77.98 136.91,77.98 138.43,76.45 IC2.2
N$33
  Bottom 0.406: R25.P$2 84.58,66.04 100.08,66.04 102.11,64.01 102.11,58.93 102.87,58.17 Q10.2
N$34
  Bottom 0.406: SG2.- 112.83,60.71 Q10.3
N$35
  Bottom 0.406: R26.P$2 69.6,91.44 71.88,93.73 85.85,93.73 90.42,89.15 Q11.2
N$36
  Bottom 0.406: LED3.K 117.86,86.61 119.63,88.39 119.63,102.36 117.6,104.39 R27.P$2
N$37
  Bottom 0.406: U$1.NWK 75.79,85.85 73.91,85.85 72.9,84.84 72.9,76.71 71.37,75.18 R26.P$1
NC1
  Bottom 0.61: K1.O 236.73,75.18 261.37,75.18 267.46,69.09 281.14,69.09 X4.3
NC2
  Bottom 0.61: X5.2 281.14,53.85 267.46,53.85 265.18,56.13 260.6,56.13 260.35,56.13 238,56.13 K2.O
NC3  (1 unrouted)
  Bottom 0.61: X6.1 281.04,38.35 | K3.O 234.57,42.29 238.25,38.61 253.24,38.61 254,37.85 280.42,37.85 280.92,38.35 281.18,38.35
NC4
  Bottom 0.61: X6.4 281.04,23.62 265.68,23.62 261.87,19.81 238.76,19.81 K4.O
NO1
  Bottom 0.61: K1.S 237.74,86.11 251.46,86.11 252.73,84.84 261.62,84.84 267.21,79.25 267.46,79.25 268.73,79.25 281.06,79.25 X4.1
NO2
  Bottom 0.61: X4.4 281.06,64.01 267.46,64.01 263.65,67.82 253.75,67.82 252.22,69.34 236.73,69.34 K2.S
NO3
  Bottom 0.61: X5.3 280.96,49.02 254.25,49.02 251.97,51.31 237.24,51.31 234.31,54.23 K3.S
NO4
  Bottom 0.61: X6.2 281.14,33.53 266.7,33.53 263.65,30.48 254.25,30.48 251.46,33.27 237.24,33.27 K4.S
RST
  Top 0.406: S1.1 S1.2
  Bottom 0.406: IC4.1 135.59,32.56 S1.2 121.89,31.47 117.35,26.92 J1.5 | R22.P$1 122.43,39.62 121.89,39.09 S1.1
SCL
  Bottom 0.406: IC4.28 135.64,47.24 132.08,50.8 132.08,57.4 133.6,58.93 R24.P$1 136.4,61.21 136.4,67.31 138.94,69.85 176.78,69.85 178.05,71.12 178.05,76.2 | IC2.6 140.97,85.09 142.24,86.36 171.2,86.36 173.99,83.57 173.99,80.52 173.74,80.26 173.99,80.26 178.05,76.2 | 178.05,76.2 178.05,76.45 177.8,76.45 177.29,76.96 170.94,76.96 169.67,78.23 IC3.6
SDA  (via drill 0.9 pad 1.78)
  Top 0.406: v185.17,78.49 184.66,78.99 v172.47,78.99
  Bottom 0.406: IC4.27 138.18,48.26 R23.P$1 135.64,52.32 137.92,54.61 137.92,66.55 140.21,68.83 184.15,68.83 185.67,70.36 185.67,77.47 185.17,77.98 v185.17,78.49 | IC2.5 143.51,84.07 144.78,85.34 170.43,85.34 172.47,83.31 172.47,82.3 IC3.5 172.21,79.25 v172.47,78.99
SN1
  Bottom 0.61: 280.96,114.55 X2.2 268.52,114.77 265.43,117.86 R10.P$2
SN2
  Bottom 0.61: R13.P$2 264.41,114.05 273.69,104.77 X2.4
SN3
  Bottom 0.61: 281.14,94.49 X3.2 271.06,94.45 268.48,97.03 268.48,105.16 263.4,110.24 R16.P$2
SN4
  Bottom 0.61: R19.P$2 263.14,106.43 265.68,103.89 265.68,86.11 267.46,84.33 280.92,84.33 281.04,84.45 X3.4
VBAT  (via drill 0.9 pad 1.78)
  Top 0.406: v105.66,18.54 v105.66,6.6
  Bottom 0.406: BATT_SWTCH.2 248.67,8.89 217.42,8.89 207.77,18.54 BATTERY.1 201.93,18.54 203.45,17.02 203.45,7.62 202.18,6.34 v105.66,6.6 | IC2.3 140.97,73.41 139.7,72.14 137.92,72.14 129.54,63.75 129.54,55.37 125.98,51.82 108.97,51.82 107.95,52.83 107.95,57.4 108.97,58.42 114.05,58.42 115.57,59.94 115.57,62.23 113.79,64.01 103.89,64.01 100.58,67.31 87.38,67.31 84.58,70.1 81.28,70.1 80.26,69.09 80.26,66.8 82.8,64.26 99.57,64.26 100.84,62.99 100.84,56.39 103.89,53.34 103.89,40.64 106.68,37.85 105.66,36.83 v105.66,18.54
XTAL1
  Bottom 0.406: IC4.9 155.96,18.16 CRYSTAL.1 C3.2
XTAL2
  Bottom 0.406: C4.2 CRYSTAL.2 158.5,16.13 IC4.10